# EAGLE design photoboard1 (EAGLE 7.5.0)
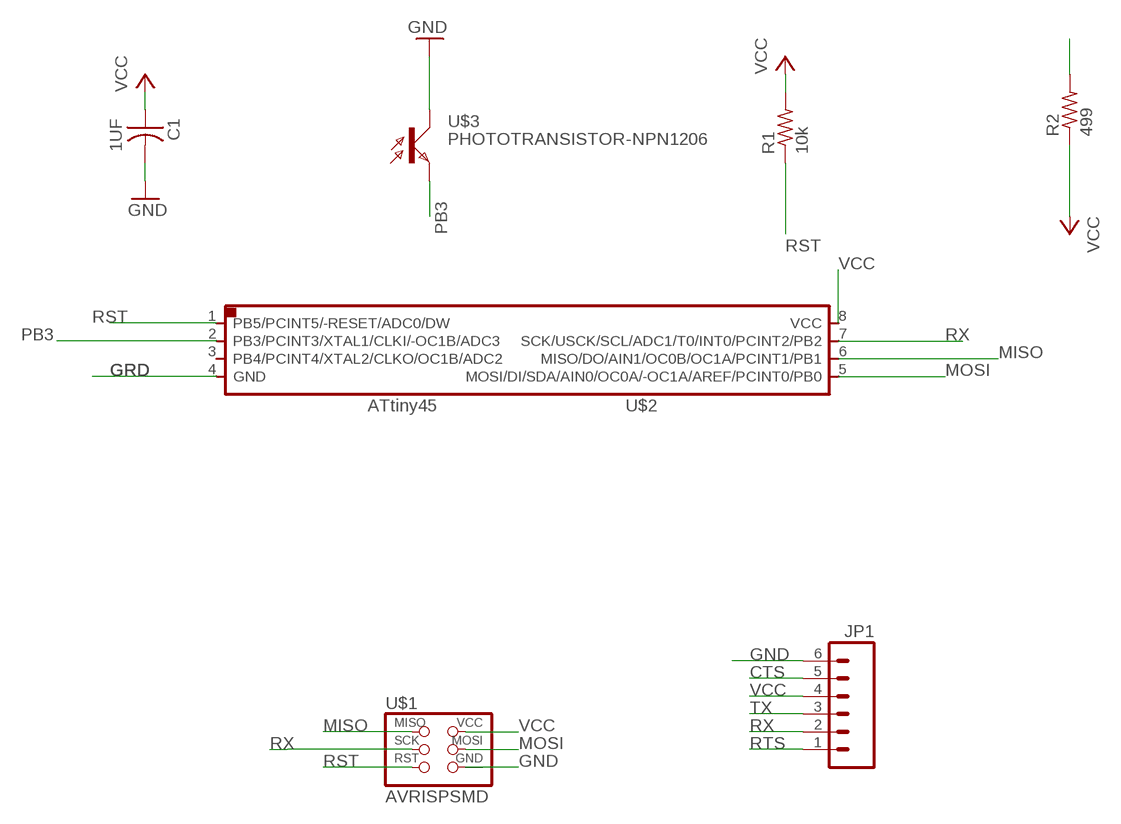
[diagram p0: schematic, sheet 1]

## Parts
C1  1UF  CAP-US1206FAB  [C1206FAB]
JP1  M06SMD  [1X06-SMD]
R1  10k  RES-US1206  [R1206]
R2  499  RES-US1206  [R1206]
U$1  AVRISPSMD  [2X03SMD]
U$2  ATTINY45SI  [SOIC8]
U$3  PHOTOTRANSISTOR-NPN1206  [OP1206]

## Nets
CTS: JP1.5
GND: C1.2 JP1.6 U$1.6(GND) U$3.COLLECTOR(C)
GRD: U$2.4(GND)
MISO: U$1.1(MISO) U$2.6(MISO/DO/AIN1/OC0B/OC1A/PCINT1/PB1)
MOSI: U$1.4(MOSI) U$2.5(MOSI/DI/SDA/AIN0/OC0A/-OC1A/AREF/PCINT0/PB0)
PB3: R2.2 U$2.2(PB3/PCINT3/XTAL1/CLKI/-OC1B/ADC3) U$3.EMITTER(E)
RST: R1.1 U$1.5(RST) U$2.1(PB5/PCINT5/-RESET/ADC0/DW)
RTS: JP1.1
RX: JP1.2 U$1.3(SCK) U$2.7(SCK/USCK/SCL/ADC1/T0/INT0/PCINT2/PB2)
TX: JP1.3
VCC: C1.1 JP1.4 R1.2 R2.1 U$1.2(VCC) U$2.8(VCC)
Unconnected: U$2.3(PB4/PCINT4/XTAL2/CLKO/OC1B/ADC2)

## Library data of the parts
C1 = fab:CAP-US
JP1 = SparkFun:M06: Header 6 Standard 6-pin 0.1" header. Use with straight break away headers (SKU : PRT-00116), right angle break away headers (PRT-00553), swiss pins (PRT-00743), machine pins (PRT-00117), and female headers (PRT-00115). Molex polarized connector foot print use with SKU : PRT-08094 with associated crimp pins and housings. NOTES ON THE VARIANTS LOCK and LOCK_LONGPADS... This footprint was designed to help hold the alignment of a through-hole component (i.e. 6-pin header) while soldering it into place. You may notice that each hole has been shifted either up or down by 0.005 of an inch from it's more standard position (which is a perfectly straight line). This slight alteration caused the pins (the squares in the middle) to touch the edges of the holes. Because they are alternating, it causes a "brace" to hold the component in place. 0.005 has proven to be the perfect amount of "off-center" position when using our standard breakaway headers. Although looks a little odd when you look at the bare footprint, once you have a header in there, the alteration is very hard to notice. Also, if you push a header all the way into place, it is covered up entirely on the bottom side. This idea of altering the position of holes to aid alignment will be further integrated into the Sparkfun Library for other footprints. It can help hold any component with 3 or more connection pins.
R1 R2 = fab:RES-US: Resistor (US Symbol) Variants with postfix FAB are widened to allow the routing of internal traces
U$1 = fab:AVRISP
U$2 = fab:ATTINY45
U$3 = fab:PHOTOTRANSISTOR-NPN

## Board
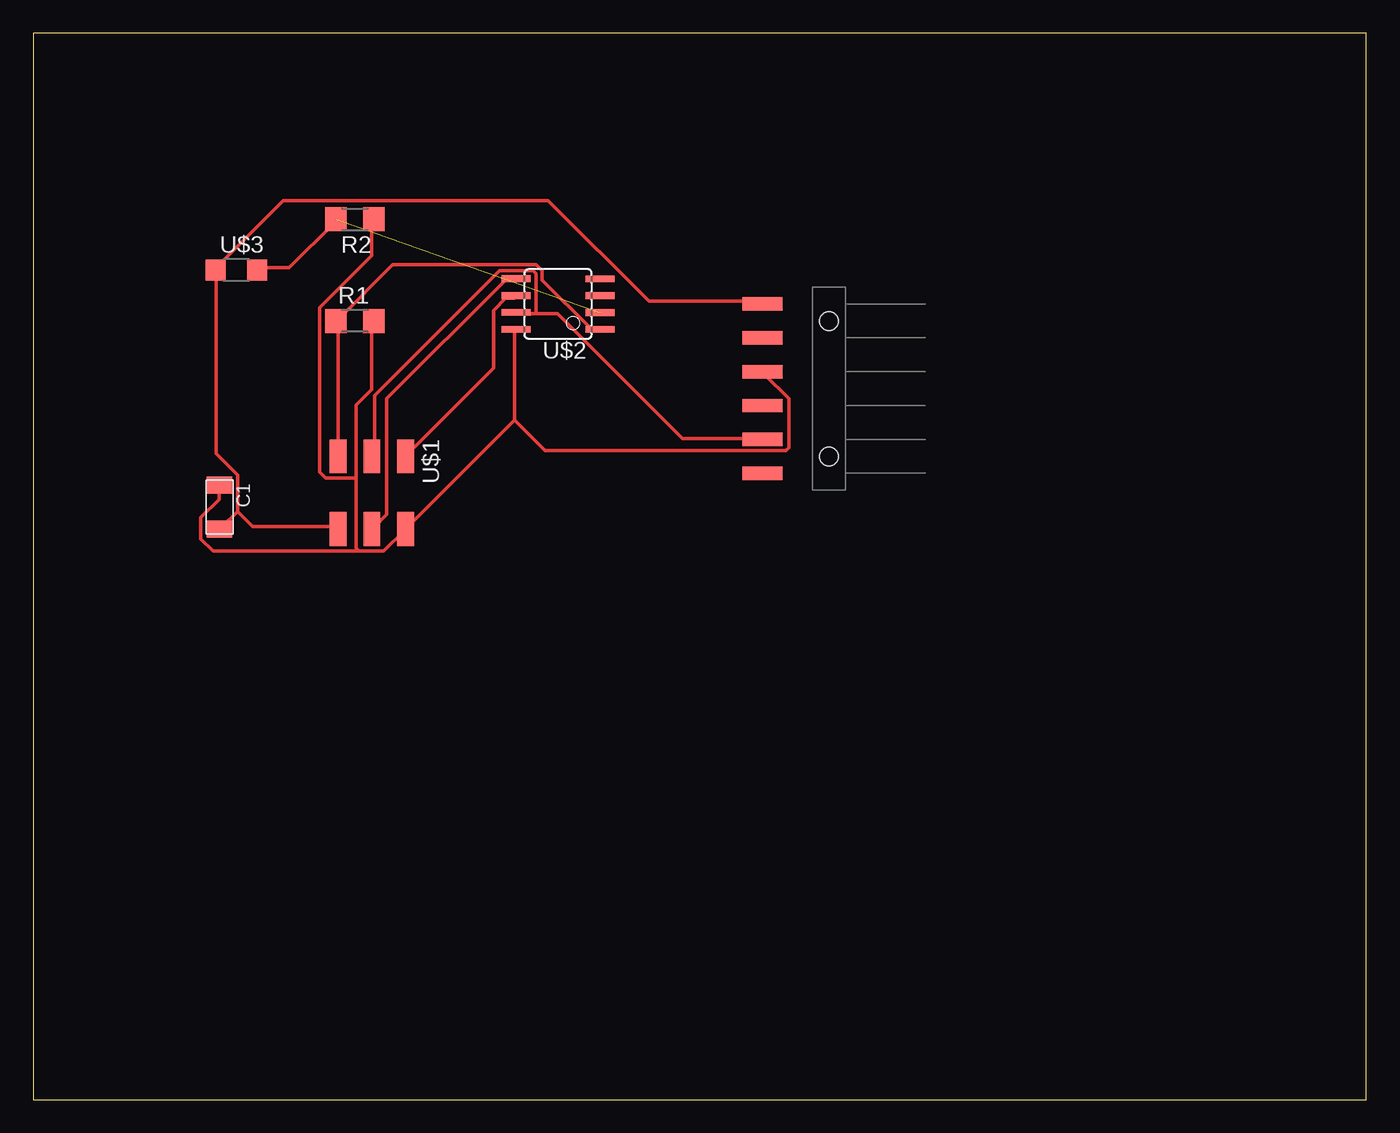
[diagram p1: board, top side]

Size 100 x 80 mm. Coordinates in mm from the lower left corner, seen from the top.
Outline: 0,0 100,0 100,80 0,80 0,0
Copper layers (1*16): Top 0.035mm / dielectric 1.5mm / Bottom 0.035mm
Design rules "default": minimum track width 10mil, minimum drill 24mil, track to track 8mil, track to pad 8mil, pad to pad 8mil, via to via 8mil, smd to smd 8mil, copper to edge 40mil, drill to drill 8mil, minimum pad ring 10mil, minimum via ring 8mil, stop-mask expansion 4mil, vias tented up to drill 0mil, thermal gap 10mil

### Footprints (pad centres in the part's own frame; a part is rotated, then mirrored left to right if it is on the bottom)
C1206FAB = smd 1.27 x 1.905: 1 -1.651,0; 2 1.651,0
1X06-SMD = smd 1 x 3: 1 -6.35,5; 2 -3.81,5; 3 -1.27,5; 4 1.27,5; 5 3.81,5; 6 6.35,5 | hole 1.4: -5.08,0; 5.08,0
R1206 = smd 1.6 x 1.803: 1 -1.422,0; 2 1.422,0
2X03SMD = smd 2.54 x 1.27: 1 -2.54,2.54; 2 2.92,2.54; 3 -2.54,0; 4 2.92,0; 5 -2.54,-2.54; 6 2.92,-2.54
SOIC8 = smd 0.5 x 2.2: 1 -1.905,-3.154; 2 -0.645,-3.154; 3 0.625,-3.154; 4 1.895,-3.154; 5 1.905,3.154; 6 0.635,3.154; 7 -0.635,3.154; 8 -1.905,3.154
OP1206 = smd 1.5 x 1.6: COLLECTOR -1.55,0; EMITTER 1.55,0

### Placement (x,y rotation side)
C1  13.97,44.45 270 top
JP1  59.69,53.34 90 top
R1  24.13,58.42 0 top
R2  24.13,66.04 180 top
U$1  25.4,45.72 270 top
U$2  39.37,59.69 90 top
U$3  15.24,62.23 0 top

### Tracks (layer width: path | path; a pad name or v marks a point on that pad's centre or on a via)
GND
  Top 0.254: 15.32,44.12 15.32,46.86 13.72,48.46 13.72,62.18 U$3.COLLECTOR 13.72,62.41 18.75,67.44 38.63,67.44 46.18,59.89 54.63,59.89 JP1.6 | 15.32,44.12 14.17,42.98 C1.2 | 15.32,44.12 16.46,42.98 22.86,42.98 U$1.6
MISO
  Top 0.254: U$2.6 36.12,60.12 35.43,60.12 34.52,59.21 34.52,54.86 28.12,48.46 U$1.1
MOSI
  Top 0.254: U$2.5 36.12,61.49 35.43,61.49 26.52,52.58 26.52,43.89 25.6,42.98 U$1.4
PB3  (1 unrouted)
  Top 0.254: U$3.EMITTER 16.92,62.41 19.2,62.41 22.63,65.84 R2.2
RST
  Top 0.254: U$1.5 22.86,58.29 R1.1 22.86,58.52 26.98,62.64 37.72,62.64 38.18,62.18 38.18,61.49 41.83,57.84 42.52,57.84 U$2.1
RX
  Top 0.254: 37.72,58.98 39.32,58.98 48.69,49.61 54.63,49.61 JP1.2 | 37.72,58.98 36.35,58.98 U$2.7 | 37.72,58.98 37.72,61.95 37.49,62.18 34.98,62.18 25.6,52.81 25.6,48.46 U$1.3
VCC
  Top 0.254: 24.23,46.63 24.23,41.38 24.46,41.15 | 24.23,46.63 24.23,52.12 25.38,53.26 25.38,58.29 R1.2 | 24.46,41.15 26.29,41.15 27.89,42.75 U$1.2 28.12,42.98 36.12,50.98 | 24.23,46.63 21.95,46.63 21.49,47.09 21.49,59.44 25.38,63.32 25.38,65.84 R2.1 | 24.46,41.15 13.49,41.15 12.57,42.06 12.57,43.66 13.95,45.03 13.95,45.95 C1.1 | 36.12,50.98 36.12,57.61 U$2.8 | 36.12,50.98 38.41,48.69 56.46,48.69 56.69,48.92 56.69,52.58 54.86,54.41 JP1.4